# EAGLE design 16053 (EAGLE 7.5.0)
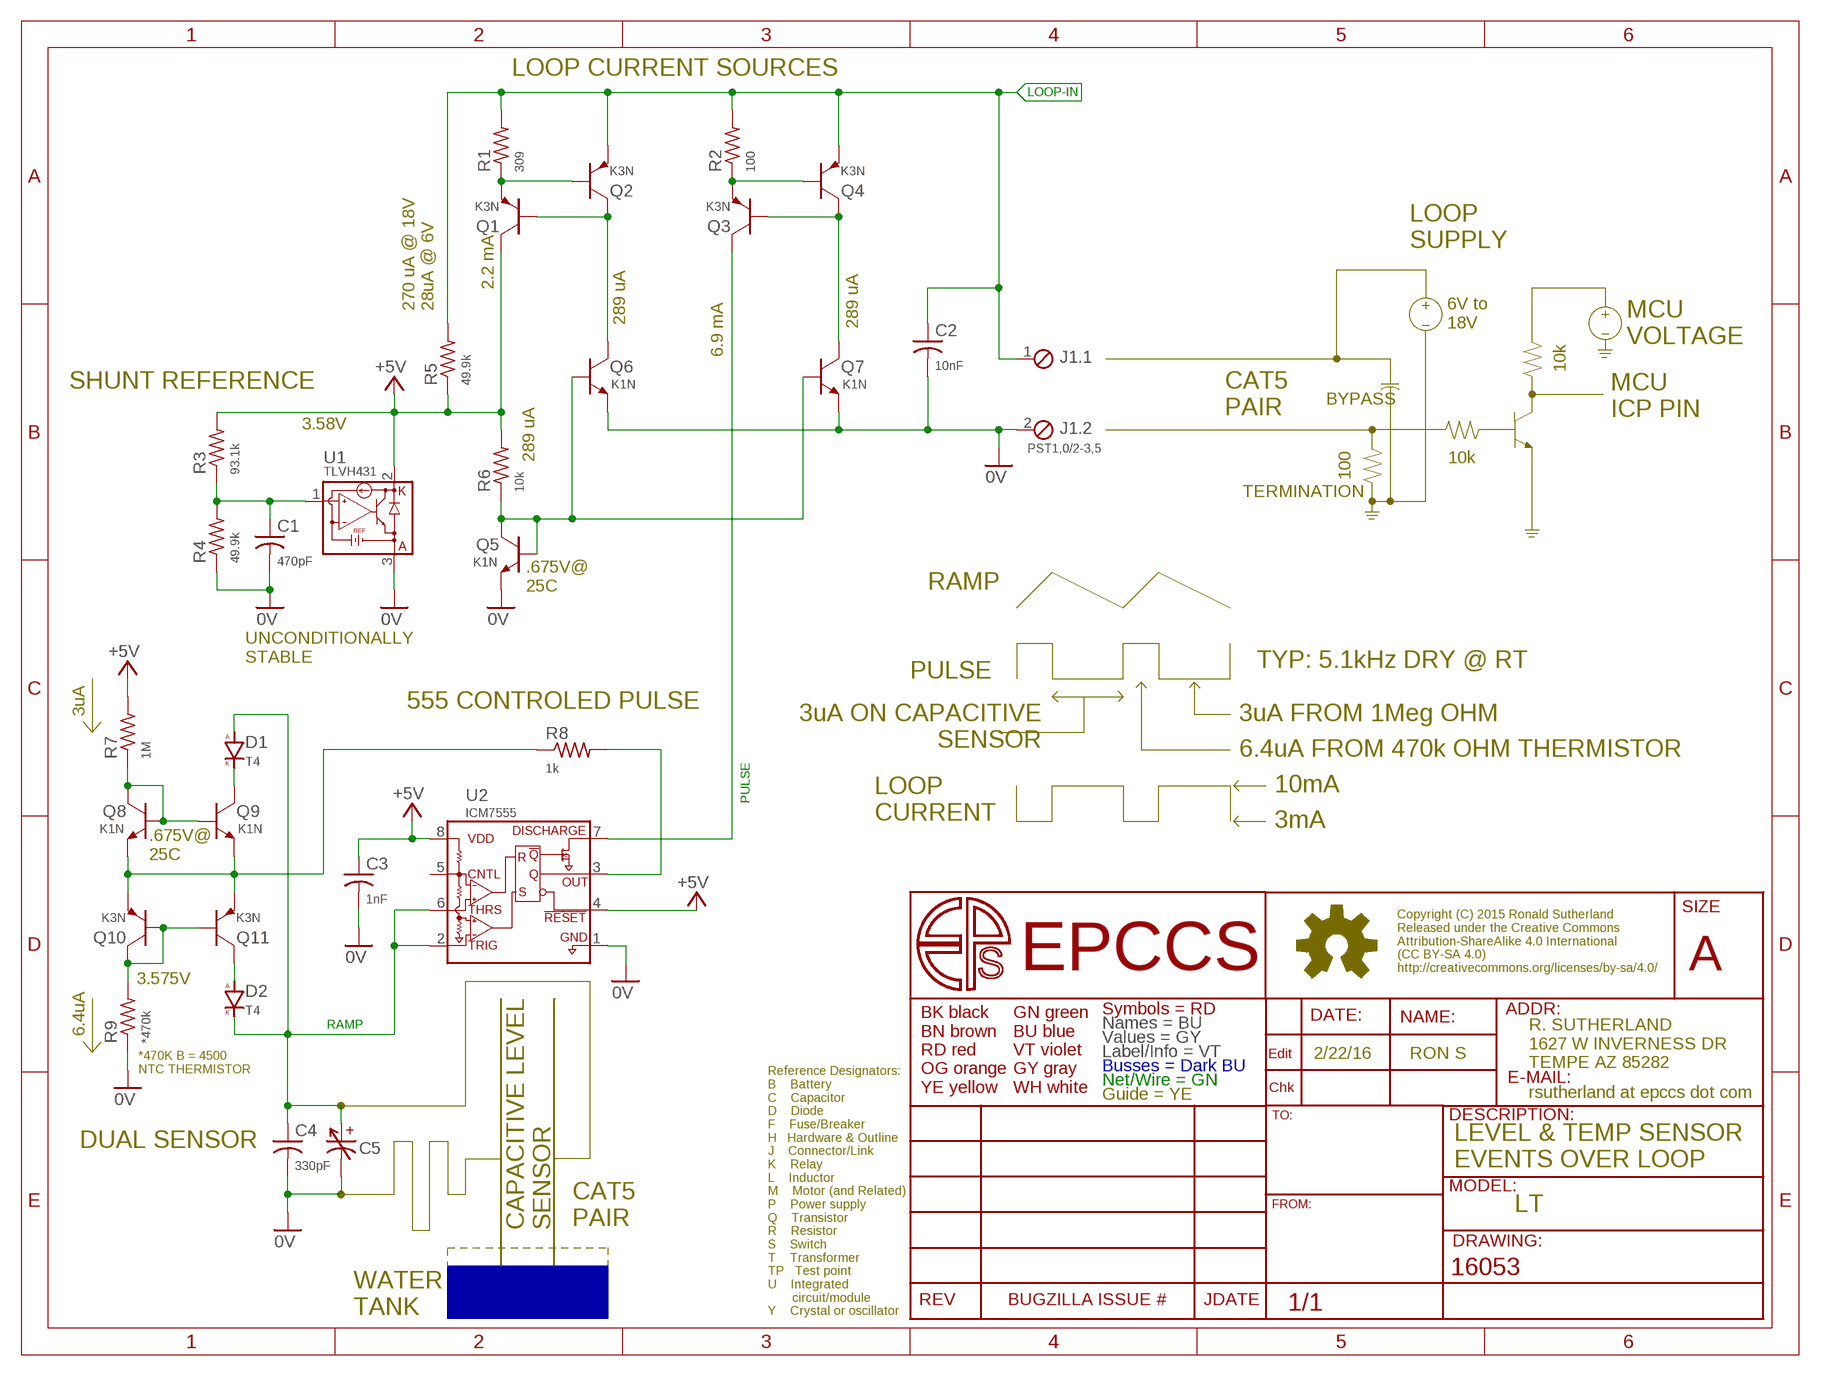
[diagram p0: schematic, sheet 1]

## Parts
C1  470pF  CC0603A  [C0603(1608)]
C2  10nF  CC0603A  [C0603(1608)]
C3  1nF  CC0603A  [C0603(1608)]
C4  330pF  CC0603A  [C0603(1608)]
C5  HS1101  [HS1101]
D1  T4  DSOD123  [SOD123]
D2  T4  DSOD123  [SOD123]
J1  PST1,0/2-3,5  MCV2  [MCV2]
Q1  K3N  PNPSOT23  [SOT23]
Q2  K3N  PNPSOT23  [SOT23]
Q3  K3N  PNPSOT23  [SOT23]
Q4  K3N  PNPSOT23  [SOT23]
Q5  K1N  NPNSOT23  [SOT23]
Q6  K1N  NPNSOT23  [SOT23]
Q7  K1N  NPNSOT23  [SOT23]
Q8  K1N  NPNSOT23  [SOT23]
Q9  K1N  NPNSOT23  [SOT23]
Q10  K3N  PNPSOT23  [SOT23]
Q11  K3N  PNPSOT23  [SOT23]
R1  309  R0805  [C0805(2012)]
R2  100  R0805  [C0805(2012)]
R3  93.1k  R0805  [C0805(2012)]
R4  49.9k  R0805  [C0805(2012)]
R5  49.9k  R0805  [C0805(2012)]
R6  10k  R0805  [C0805(2012)]
R7  1M  R0805  [C0805(2012)]
R8  1k  R0805  [C0805(2012)]
R9  *470k  R0805  [C0805(2012)]
U1  TLVH431  TL432SOT23  [SOT23]
U2  ICM7555  [SOIC8]

## Nets
0V: C1.2 C2.2 C3.2 C4.2 C5.2 J1.2 Q5.E Q6.E Q7.E R4.1 R9.1 U1.3(A) U2.1(GND)
+5V: C3.1 Q1.C R3.2 R5.1 R6.2 R7.2 U1.2(K) U2.4(!RESET) U2.8(VDD)
LOOP-IN: C2.1 J1.1 Q2.E Q4.E R1.2 R2.2 R5.2
N$1: Q10.B Q10.C Q11.B R9.2
N$2: R8.2 U2.3(OUT)
N$3: Q1.E Q2.B R1.1
N$4: D2.A Q11.C
N$5: Q8.E Q9.E Q10.E Q11.E R8.1
N$6: Q8.B Q8.C Q9.B R7.1
N$7: Q5.B Q5.C Q6.B Q7.B R6.1
N$8: D1.C(K) Q9.C
N$9: Q1.B Q2.C Q6.C
N$10: Q3.E Q4.B R2.1
N$12: Q3.B Q4.C Q7.C
N$14: C1.1 R3.1 R4.2 U1.1(REF)
PULSE: Q3.C U2.7(DISCHARGE)
RAMP: C4.1 C5.1 D1.A D2.C(K) U2.2(TRIG) U2.6(THRS)
Unconnected: U2.5(CNTL)

## Notes on the sheet
- LOOP CURRENT SOURCES
- LOOP
  SUPPLY
- 2.2 mA
- 270 uA @ 18V
  28uA @ 6V
- 289 uA | 289 uA
- 6V to
  18V
- 10k
- MCU
  VOLTAGE
- 6.9 mA
- SHUNT REFERENCE
- BYPASS
- CAT5
  PAIR
- MCU
  ICP PIN
- 3.58V
- 10k
- 289 uA
- 100
- TERMINATION
- RAMP
- .675V@
  25C
- UNCONDITIONALLY 
  STABLE
- TYP: 5.1kHz DRY @ RT
- PULSE
- 3uA ON CAPACITIVE
  SENSOR
- 555 CONTROLED PULSE
- 3uA
- 3uA FROM 1Meg OHM
- 6.4uA FROM 470k OHM THERMISTOR
- 10mA
- LOOP
  CURRENT
- 3mA
- .675V@
  25C
- 3.575V
- 6.4uA
- 2/22/16 | RON S
- *470K B = 4500
  NTC THERMISTOR
- DUAL SENSOR
- LEVEL & TEMP SENSOR 
  EVENTS OVER LOOP
- LT
- CAT5
  PAIR
- CAPACITIVE LEVEL
  SENSOR
- WATER
  TANK

## Library data of the parts
C1-C4 = C-C:C: CAPACITOR Symbol
C5 = U-Sensor:HS1101: HS1101LF [MEASUE_SPEC,HPP801A031] SENSOR HUMIDITY CAPACITIVE THRU connect pin 2 (case of header) to ground of circuit
D1 D2 = D-GP:D: DIODE
J1 = J-HDR3.5mm:MCV2: MCV 1,5/ 2-G-3,5-RN [PHOENIX CONTACT,1731471] CONN HEADER SHROUDED 2POS 3.5MM MCVR 1,5/ 2-ST-3,5 [PHOENIX CONTACT,1863152] CONN PLUG 2POS SCREW 3.5MM PST 1,0/2-3,5 [PHOENIX CONTACT,1945096] CONN HEADER STRIP PIN 2POS 3.5MM PT1,5/2-PVH-3,5 [PHOENIX CONTACT,1984015] CONN PLUG STRIP 2POS 3.5MM
Q1-Q4 Q10 Q11 = Q-PNP:PNP: BJT NPN General Purpose Amplifier
Q5-Q9 = Q-NPN:NPN: BJT NPN General Purpose Amplifier
R1-R9 = R-C:R: Resiistor American-style symbol
U1 = U-Linear:TL432: WARNING: watch out for pinout on TL*43x BB [DIODES,TL432BSA-7] 2V5REF SHUNT ADJ 36V SOT23 Y3T [TI,TLVH431AIDBZ] 1V24REF SHUNT ADJ 18V SOT23
U2 = U-Time:ICM7555: ICM7555 [INTERSIL,ICM7555IBAZ-T] TIMER 555 8SOIC note each resistor in Maxim part is 100k +/- 20%

## Board
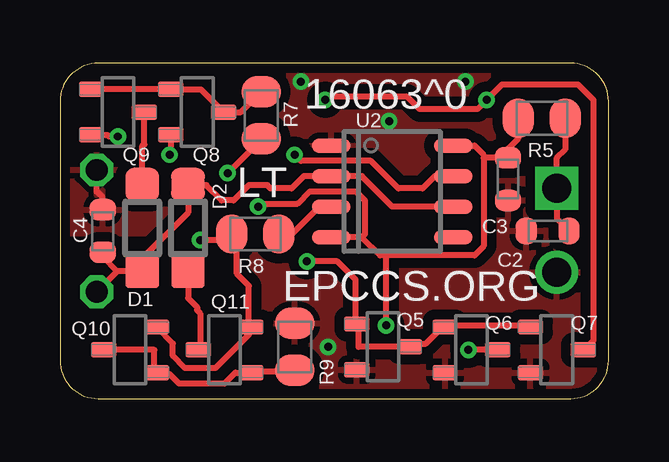
[diagram p1: board, top side]
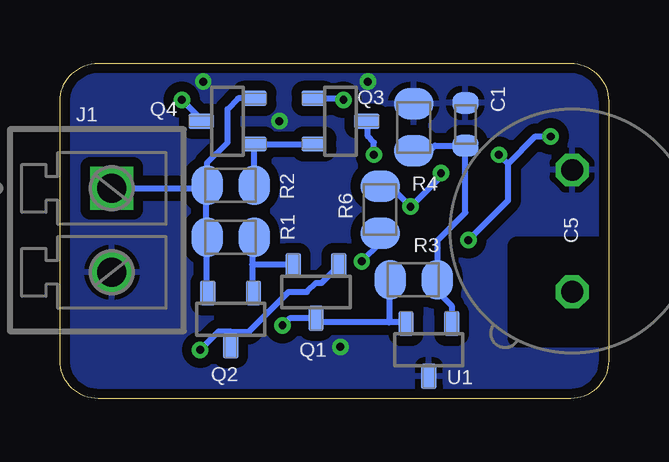
[diagram p2: board, bottom side, seen from below]

Size 22.86 x 13.97 mm. Coordinates in mm from the lower left corner, seen from the top.
Outline: 22.86,1.59 22.86,12.38 arc90 21.27,13.97 1.59,13.97 arc90 0,12.38 0,1.59 arc90 1.59,0 21.27,0 arc90 22.86,1.59
Copper layers (1*16): Top 0.0356mm / dielectric 1.5011mm / Bottom 0.0356mm
Design rules "oshpark-2layer *": minimum track width 10mil, minimum drill 13mil, track to track 8mil, track to pad 8mil, pad to pad 8mil, via to via 8mil, smd to smd 6mil, copper to edge 15mil, drill to drill 12mil, minimum pad ring 7mil, minimum via ring 7mil, stop-mask expansion 4mil, vias tented up to drill 17mil, thermal gap 10mil
tRestrict: area 0,2.5 to 3.8,6.3
bRestrict: area 0,2.5 to 3.8,6.3

### Footprints (pad centres in the part's own frame; a part is rotated, then mirrored left to right if it is on the bottom)
C0603(1608) = smd 0.898 x 1.1: 1 -0.889,0; 2 0.889,0
HS1101 = drill 0.914 octagon: 1 -2.54,0; 2 2.54,0
SOD123 = smd 1.4 x 1.4: A 1.8,0; C -1.8,0
MCV2 = drill 1.2 square: 1 0,0 | drill 1.2: 2 3.5,0
SOT23 = smd 0.65 x 1.06: B -0.95,-1.1; C 0,1.1; E 0.95,-1.1
C0805(2012) = smd 1.321 x 1.651: 1 -0.977,0; 2 0.977,0
SOT23' = smd 0.65 x 1.06: 1 -0.95,-1.1; 2 0.95,-1.1; 3 0,1.1
SOIC8 = smd 0.6 x 1.6: 1 -1.905,-2.54; 2 -0.635,-2.54; 3 0.635,-2.54; 4 1.905,-2.54; 5 1.905,2.54; 6 0.635,2.54; 7 -0.635,2.54; 8 -1.905,2.54

### Placement (x,y rotation side)
C1  5.97,11.43 90 bottom
C2  20.32,6.99 180 top
C3  18.67,9.14 270 top
C4  1.78,6.99 90 top
C5  1.52,6.99 90 bottom
D1  3.43,7.11 270 top
D2  5.33,7.11 270 top
J1  20.7,8.76 270 bottom
Q1  12.19,4.45 180 bottom
Q2  15.75,3.3 180 bottom
Q3  11.18,11.56 270 bottom
Q4  15.88,11.56 90 bottom
Q5  13.46,2.16 270 top
Q6  17.14,2.03 270 top
Q7  20.7,2.03 270 top
Q8  5.71,11.94 270 top
Q9  2.41,11.94 270 top
Q10  2.92,2.03 90 top
Q11  6.86,2.03 90 top
R1  15.75,6.73 180 bottom
R2  15.75,8.89 180 bottom
R3  8.13,4.95 180 bottom
R4  8.13,11.3 270 bottom
R5  20.07,11.68 0 top
R6  9.53,7.87 90 bottom
R7  8.38,11.81 270 top
R8  8.13,6.86 0 top
R9  9.78,2.16 270 top
U1  TLVH431  [SOT23']  7.49,2.03 180 bottom
U2  13.84,8.64 270 top

### Tracks (layer width: path | path; a pad name or v marks a point on that pad's centre or on a via)
0V  (via drill 0.33)
  Top 0.254: C4.2 1.78,8.38 1.52,8.64 C5.2
  other vias: 13.72,11.56 10.03,13.21 11.18,2.16 16.89,13.21
  pour Top (isolate 0.406): 0,13.97 22.86,13.97 22.86,0 0,0
  pour Bottom (isolate 0.406): 0,13.97 22.86,13.97 22.86,0 0,0
+5V  (via drill 0.33)
  Top 0.254: U2.8 17.27,10.54 17.65,10.16 17.65,10.03 | 17.65,10.03 17.65,6.35 17.27,5.97 13.59,5.97 | 13.59,5.97 13.34,5.97 12.57,6.73 | 12.57,6.73 U2.4 | v13.59,3.05 13.59,5.97 | v8.26,8 8.38,8.13 9.91,8.13 10.41,8.64 12.32,8.64 12.7,8.26 12.7,6.86 12.57,6.73 | R7.2 8.42,10.83 v6.99,9.4 | 17.65,10.03 C3.1 18.67,10.41 19.09,10.83 R5.1
  Bottom 0.254: 12.19,3.3 Q1.C | Q1.C 13.29,3.35 v13.59,3.05 | R6.2 9.11,8.85 v8.26,8 6.99,9.27 v6.99,9.4 | 9.14,3.17 8.51,3.17 U1.2 | 9.14,3.17 9.14,4.95 R3.2 | 9.14,3.17 12.02,3.17 Q1.C
LOOP-IN
  Top 0.254: C2.1 20.7,7.49 J1.1 20.7,10.03 21.04,10.38 R5.2
  Bottom 0.254: 16.76,6.73 16.76,4.57 Q2.E | 16.76,6.73 16.76,8.76 | 16.76,8.76 16.76,8.89 R2.2 | 16.76,6.73 R1.2 | J1.1 16.76,8.76 | 16.76,8.76 R2.2 | R2.2 16.73,9.82 15.88,10.67 15.88,12.06 15.43,12.51 Q4.E
N$1
  Top 0.254: Q10.C 3.94,2.03 3.94,1.14 Q10.B 4.06,1.02 4.57,1.02 4.95,0.64 6.86,0.64 7.3,1.08 Q11.B 8,1.14 9.78,1.14 R9.2
N$2
  Top 0.254: U2.3 10.79,8 9.65,6.86 R8.2
N$3
  Bottom 0.254: 14.86,5.59 14.86,6.73 R1.1 | 14.86,5.59 14.86,4.45 Q2.B | 14.86,5.59 13.21,5.59 Q1.E
N$4
  Top 0.254: D2.A 5.33,4.19 5.71,3.81 5.71,3.68 5.84,3.56 5.84,2.03 Q11.C
N$5  (via drill 0.33)
  Top 0.254: Q10.E 4.06,2.92 4.7,2.29 4.7,1.78 5.21,1.27 6.48,1.27 7.87,2.67 7.87,2.92 Q11.E 7.87,3.05 7.87,4.7 7.37,5.21 7.37,6.73 7.24,6.86 R8.1 7.11,6.86 7.11,6.6 v5.84,6.6 | Q8.E 4.62,10.2 v4.57,10.16 | v2.41,10.92 2.03,10.92 1.97,10.99 Q9.E
  Bottom 0.254: 4.19,9.78 v4.57,10.16 | 4.19,9.78 4.19,8.26 v5.84,6.6 | 4.19,9.78 3.05,10.92 v2.41,10.92
N$6
  Top 0.254: Q9.B Q8.B 5.87,12.89 Q8.C 7.53,11.94 R7.1
N$7  (via drill 0.33)
  Top 0.254: Q7.B 19.56,3.05 16.13,3.05 Q6.B 16,2.92 15.75,2.92 15.75,2.79 15.24,2.29 14.61,2.29 14.61,2.16 Q5.C 12.45,2.16 12.45,3.05 Q5.B 12.32,3.17 12.32,4.95 11.56,5.71 v10.29,5.71
  Bottom 0.254: R6.1 9.53,6.48 v10.29,5.71
N$8
  Top 0.254: D1.C 3.43,10.54 3.51,10.58 Q9.C
N$9  (via drill 0.33)
  Top 0.254: 18.29,2.03 Q6.C v17.02,2.03
  Bottom 0.254: 11.3,5.59 Q1.B 11.96,4.83 12.19,4.83 12.57,4.45 13.34,4.45 14.99,2.79 15.75,2.79 | v17.02,2.03 16.26,2.79 15.75,2.79 | 15.75,2.79 Q2.C
N$10
  Bottom 0.254: R2.1 Q4.B Q3.E
N$12  (via drill 0.33)
  Top 0.254: v11.05,12.45 11.18,12.57 14.48,12.57 14.99,12.06 17.4,12.06 v17.78,12.45 18.41,13.08 21.59,13.08 22.23,12.45 22.23,2.41 21.84,2.03 Q7.C
  Bottom 0.254: Q3.B 11.11,12.51 v11.05,12.45 | Q4.C 17.02,11.68 v17.78,12.45
N$14
  Bottom 0.254: R4.2 8.13,10.41 7.37,10.41 7.24,10.54 C1.1 5.97,7.75 7.11,6.6 7.11,4.95 | 7.11,4.95 7.11,4.45 6.54,3.88 U1.1 | 7.11,4.95 R3.1
PULSE  (via drill 0.33)
  Top 0.254: U2.7 15.62,9.27 15.11,8.76 14.1,8.76 12.95,9.91 10.03,9.91 v9.78,10.16
  Bottom 0.254: v9.78,10.16 9.78,10.67 10.03,10.92 10.03,11.51 Q3.C
RAMP
  Top 0.254: C5.1 2.39,5.31 | 2.39,5.31 D1.A 3.43,5.84 5.33,7.75 D2.C 5.36,8.89 6.1,8.89 6.73,8.26 7.24,8.26 7.87,8.89 8.64,8.89 8.76,8.76 9.65,8.76 10.16,9.27 U2.2 12.57,9.27 13.84,8 U2.6 | C4.1 1.78,5.92 2.39,5.31

### Text on the board
tPlace: 16063^0 | LT | EPCCS.ORG